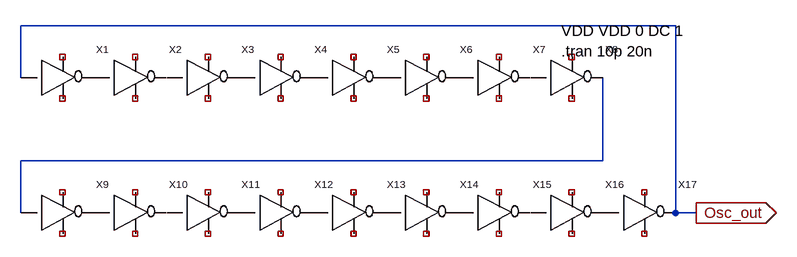
[diagram p0: schematic Draft2.asc]
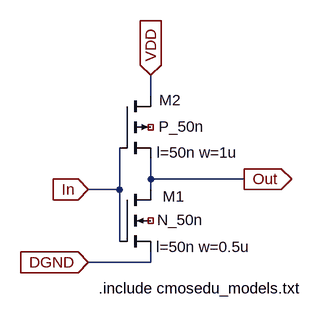
[diagram p1: sub-circuit invert.asc]
Draft2.asc, the LTspice schematic file:
Version 4
SHEET 1 1160 680
WIRE 960 32 -48 32
WIRE -48 112 -48 32
WIRE 848 240 848 112
WIRE 848 240 -48 240
WIRE -48 320 -48 240
WIRE 960 320 960 32
WIRE 992 320 960 320
FLAG 992 320 Osc_out
IOPIN 992 320 Out
SYMBOL invert -16 112 R0
SYMATTR InstName X1
SYMBOL invert 96 112 R0
SYMATTR InstName X2
SYMBOL invert 208 112 R0
SYMATTR InstName X3
SYMBOL invert 320 112 R0
SYMATTR InstName X4
SYMBOL invert 432 112 R0
SYMATTR InstName X5
SYMBOL invert 544 112 R0
SYMATTR InstName X6
SYMBOL invert 656 112 R0
SYMATTR InstName X7
SYMBOL invert 768 112 R0
SYMATTR InstName X8
SYMBOL invert -16 320 R0
SYMATTR InstName X9
SYMBOL invert 96 320 R0
SYMATTR InstName X10
SYMBOL invert 208 320 R0
SYMATTR InstName X11
SYMBOL invert 320 320 R0
SYMATTR InstName X12
SYMBOL invert 432 320 R0
SYMATTR InstName X13
SYMBOL invert 544 320 R0
SYMATTR InstName X14
SYMBOL invert 656 320 R0
SYMATTR InstName X15
SYMBOL invert 768 320 R0
SYMATTR InstName X16
SYMBOL invert 880 320 R0
SYMATTR InstName X17
TEXT 784 40 Left 2 !VDD VDD 0 DC 1\n.tran 10p 20n

invert.asc, the sub-circuit schematic file:
Version 4
SHEET 1 880 680
WIRE 16 48 16 16
WIRE 16 176 16 144
WIRE 160 176 16 176
WIRE -32 192 -32 128
WIRE -32 192 -80 192
WIRE 16 192 16 176
WIRE -32 272 -32 192
WIRE 16 304 16 288
WIRE 16 304 -80 304
FLAG 16 16 VDD
IOPIN 16 16 In
FLAG -80 192 In
IOPIN -80 192 In
FLAG 160 176 Out
IOPIN 160 176 Out
FLAG -80 304 DGND
IOPIN -80 304 In
SYMBOL nmos4 -32 192 R0
WINDOW 0 66 11 Left 2
WINDOW 3 58 47 Left 2
WINDOW 123 56 88 Left 2
SYMATTR InstName M1
SYMATTR Value N_50n
SYMATTR Value2 l=50n w=0.5u
SYMBOL pmos4 -32 48 R0
WINDOW 0 61 6 Left 2
WINDOW 3 60 47 Left 2
WINDOW 123 57 87 Left 2
SYMATTR InstName M2
SYMATTR Value P_50n
SYMATTR Value2 l=50n w=1u
TEXT -64 344 Left 2 !.include cmosedu_models.txt

The netlist it stands for:
* Draft2.asc
XX1 Osc_out NC_01 NC_02 P001 invert
XX2 P001 NC_03 NC_04 P002 invert
XX3 P002 NC_05 NC_06 P003 invert
XX4 P003 NC_07 NC_08 P004 invert
XX5 P004 NC_09 NC_10 P005 invert
XX6 P005 NC_11 NC_12 P006 invert
XX7 P006 NC_13 NC_14 P007 invert
XX8 P007 NC_15 NC_16 N001 invert
XX9 N001 NC_17 NC_18 P008 invert
XX10 P008 NC_19 NC_20 P009 invert
XX11 P009 NC_21 NC_22 P010 invert
XX12 P010 NC_23 NC_24 P011 invert
XX13 P011 NC_25 NC_26 P012 invert
XX14 P012 NC_27 NC_28 P013 invert
XX15 P013 NC_29 NC_30 P014 invert
XX16 P014 NC_31 NC_32 P015 invert
XX17 P015 NC_33 NC_34 Osc_out invert

* block symbol definitions
.subckt invert In VDD DGND Out
M1 Out In DGND NC_01 N_50n l=50n w=0.5u
M2 VDD In Out NC_02 P_50n l=50n w=1u
.include cmosedu_models.txt
.ends invert

.model NMOS NMOS
.model PMOS PMOS
.lib standard.mos
VDD VDD 0 DC 1
.tran 10p 20n
.backanno
.end